# Altium schematic sheet Architecture.SchDoc
size A4; SheetNumber: 1; SheetTotal: 1
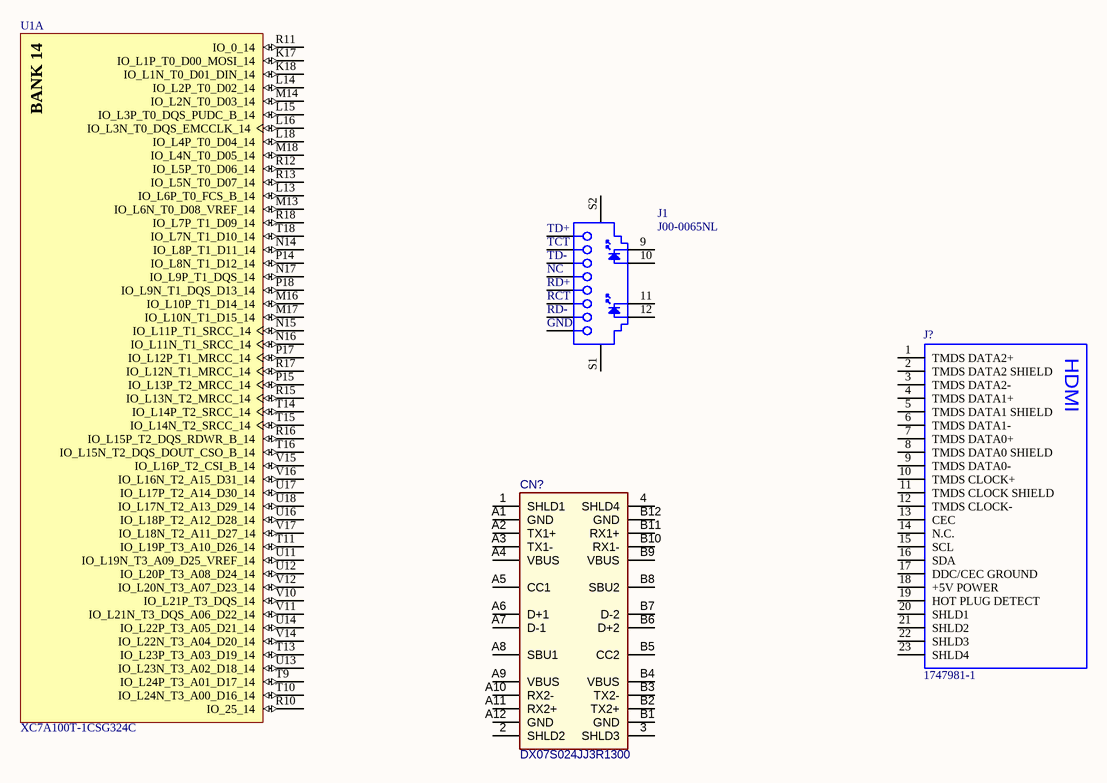
[diagram p0: Architecture.SchDoc]

## Parts
CN?  DX07S024JJ3R1300  [JAE-DX07S024JJ3_V]
J1  J00-0065NL  [PULS-J00-006XNL-E_V]
J?  1747981-1  [TE-1747981-1_V]
U1  XC7A100T-1CSG324C  [CSG324]  (part A of 9)

## Nets

Not connected (* = marked no-connect by the designer): CN? 1(SHLD1) 2(SHLD2) 3(SHLD3) 4(SHLD4) A1(GND) A2(TX1+) A3(TX1-) A4(VBUS) A5(CC1) A6(D+1) A7(D-1) A8(SBU1) A9(VBUS) A10(RX2-) A11(RX2+) A12(GND) B1(GND) B2(TX2+) B3(TX2-) B4(VBUS) B5(CC2) B6(D+2) B7(D-2) B8(SBU2) B9(VBUS) B10(RX1-) B11(RX1+) B12(GND); J1 1(TD+) 2(TCT) 3(TD-) 4(NC) 5(RD+) 6(RCT) 7(RD-) 8(GND) 9 10 11 12 S1 S2; J? 1(TMDS_DATA2+) 2(TMDS_DATA2_SHIELD) 3(TMDS_DATA2-) 4(TMDS_DATA1+) 5(TMDS_DATA1_SHIELD) 6(TMDS_DATA1-) 7(TMDS_DATA0+) 8(TMDS_DATA0_SHIELD) 9(TMDS_DATA0-) 10(TMDS_CLOCK+) 11(TMDS_CLOCK_SHIELD) 12(TMDS_CLOCK-) 13(CEC) 14(N.C.) 15(SCL) 16(SDA) 17(DDC/CEC_GROUND) 18(+5V_POWER) 19(HOT_PLUG_DETECT) 20(SHLD1) 21(SHLD2) 22(SHLD3) 23(SHLD4); U1 K17(IO_L1P_T0_D00_MOSI_14) K18(IO_L1N_T0_D01_DIN_14) L13(IO_L6P_T0_FCS_B_14) L14(IO_L2P_T0_D02_14) L15(IO_L3P_T0_DQS_PUDC_B_14) L16(IO_L3N_T0_DQS_EMCCLK_14) L18(IO_L4P_T0_D04_14) M13(IO_L6N_T0_D08_VREF_14) M14(IO_L2N_T0_D03_14) M16(IO_L10P_T1_D14_14) M17(IO_L10N_T1_D15_14) M18(IO_L4N_T0_D05_14) N14(IO_L8P_T1_D11_14) N15(IO_L11P_T1_SRCC_14) N16(IO_L11N_T1_SRCC_14) N17(IO_L9P_T1_DQS_14) P14(IO_L8N_T1_D12_14) P15(IO_L13P_T2_MRCC_14) P17(IO_L12P_T1_MRCC_14) P18(IO_L9N_T1_DQS_D13_14) R10(IO_25_14) R11(IO_0_14) R12(IO_L5P_T0_D06_14) R13(IO_L5N_T0_D07_14) R15(IO_L13N_T2_MRCC_14) R16(IO_L15P_T2_DQS_RDWR_B_14) R17(IO_L12N_T1_MRCC_14) R18(IO_L7P_T1_D09_14) T9(IO_L24P_T3_A01_D17_14) T10(IO_L24N_T3_A00_D16_14) T11(IO_L19P_T3_A10_D26_14) T13(IO_L23P_T3_A03_D19_14) T14(IO_L14P_T2_SRCC_14) T15(IO_L14N_T2_SRCC_14) T16(IO_L15N_T2_DQS_DOUT_CSO_B_14) T18(IO_L7N_T1_D10_14) U11(IO_L19N_T3_A09_D25_VREF_14) U12(IO_L20P_T3_A08_D24_14) U13(IO_L23N_T3_A02_D18_14) U14(IO_L22P_T3_A05_D21_14) U16(IO_L18P_T2_A12_D28_14) U17(IO_L17P_T2_A14_D30_14) U18(IO_L17N_T2_A13_D29_14) V10(IO_L21P_T3_DQS_14) V11(IO_L21N_T3_DQS_A06_D22_14) V12(IO_L20N_T3_A07_D23_14) V14(IO_L22N_T3_A04_D20_14) V15(IO_L16P_T2_CSI_B_14) V16(IO_L16N_T2_A15_D31_14) V17(IO_L18N_T2_A11_D27_14)

## Notes on the sheet
- (in symbol CMP-002-00012-2) HDMI
- (in symbol CMP-016-00010-1, part A) BANK 14

## Library data of the parts
CN? = CMP-002-00065-3: USB-C Connector, 20 V, 1.25 A, -30 to 80 degC, RoHS, Tape and Reel; Gender: Receptacle; Pins: 28; Connector Type: USB-C
J1 = CMP-002-00004-2: 1x1 Tab-Down RJ45, Pitch 1.27 mm, 8 Position, 0 to 70 degC, 8-Pin THD, RoHS, Bulk; Manufacturer: Pulse Electronics; Capacitance: -45f; Connector Type: SDCard; Gender: Female; Shielding: Shielded; Colour: Yellow; Manufacturer URL: http://www.pulseelectronics.com/; Pins: 8; Contact Plating: Gold; Min Operating Temperature: 0°C; Contact Material: Bronze; Datasheet URL: http://productfinder.pulseeng.com/products/datasheets/J403.pdf; Packaging: Bulk; Max Operating Temperature: 70°C; Package Description: 12-Pin Through Hole Device, Body 21.59 x 16.26 mm, Pitch 1.27 mm; Lead Pitch: 2.54mm; Datasheet Version: Aug-12; Package Reference: J00-0065NL; Case/Package: J00-0065NL; Package Quantity: 25; Mounting Technology: TH; Contact Finish: Gold; RoHS Compliant: True
J? = CMP-002-00012-2: HDMI Receptacle, Pitch 0.5 mm, 19 Position, Height 6.38 mm, RoHS, Tape and Reel; Manufacturer: TE Connectivity; Gender: Female; Connector Type: Display; Voltage Rating: 40V; Package Reference: 1747981-1; Packaging: TapeandReel; Colour: Silver; Datasheet Version: Rev. F5, 12/2015; Case/Package: Metal; Contact Plating: Gold; Package Description: HDMI Receptacle, Pitch 0.5 mm, 19 Position, Height 6.38 mm; RoHS Compliant: True; Manufacturer URL: http://www.te.com/; Contact Material: Copper; Package Quantity: 300; Pins: 19; Lead Pitch: 0.5mm; Datasheet URL: http://www.te.com/commerce/DocumentDelivery/DDEController?Action=showdoc&DocId=Customer+Drawing%7F1747981%7FF5%7Fpdf%7FEnglish%7FENG_CD_1747981_F5.pdf%7F1747981-1; Mounting Technology: SM
U1 = CMP-016-00010-1: Field Programmable Gate Array, 7925 CLBs, 1098MHz, 101440-Cell, PBGA324; Nominal Supply Voltage: 1V; Package Body Material: Plastic; Min Supply Voltage: 950mV; Max Supply Voltage: 1.05V; Number of Outputs: 210; Number of Logic Elements/Cells: 101440; Clock Frequency: 1.098GHz; Qualification Status: Not Qualified; Number of CLBs: 7925; Combinatorial Delay of a CLB-Max: 1.27ns; Terminal Finish: Copper; Moisture Sensitivity Level: 3; Terminal Position: BOTTOM; Max Operating Temperature: 85°C; Pins: 324; Case/Package: LFBGA; Number of Inputs: 210; Power Supplies: 1V; Height - Seated (Max): 1.5mm; Surface Mount: Yes; Package Style: GRID ARRAY, LOW PROFILE, FINE PITCHMeter; JESD-609 Code: e1; Reach SVHC Compliant: Yes; Programmable Logic Type: FIELD PROGRAMMABLE GATE ARRAY; Terminal Pitch: 0.8mm; Package Shape: Square; Width: 15mm; Terminal Form: Ball; Length: 15mm; RoHS Compliant: Yes; Temperature Grade: OTHER; Technology: CMOS; Min Operating Temperature: 0°C